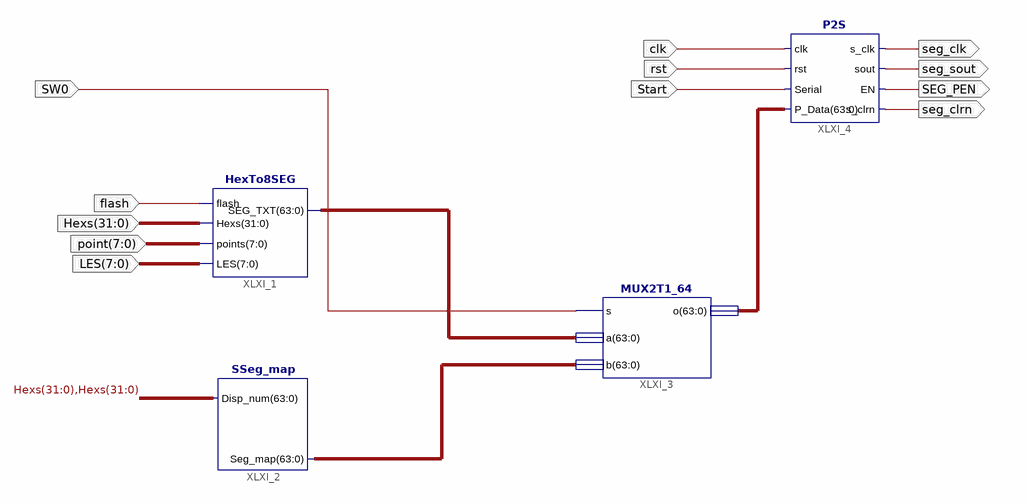
[diagram p0: schematic sheet 1]
// Xilinx ISE schematic Display.sch (kintex7) as structural Verilog: 4 symbols, 12 ports
module Display (
  input  [7:0] LES,
  input  [7:0] point,
  input  [31:0] Hexs,
  input  flash,
  input  SW0,
  input  Start,
  input  rst,
  input  clk,
  output seg_clrn,
  output SEG_PEN,
  output seg_sout,
  output seg_clk
);

  wire [63:0] XLXN_1, XLXN_2, XLXN_8;

  HexTo8SEG XLXI_1 (.LES(LES), .points(point), .Hexs(Hexs), .SEG_TXT(XLXN_1), .flash(flash));
  SSeg_map XLXI_2 (.Disp_num({Hexs, Hexs}), .Seg_map(XLXN_2));
  MUX2T1_64 XLXI_3 (.s(SW0), .a(XLXN_1), .b(XLXN_2), .o(XLXN_8));
  P2S XLXI_4 (
    .s_clrn(seg_clrn), .sout(seg_sout), .rst(rst), .EN(SEG_PEN), .Serial(Start), .clk(clk), .s_clk(seg_clk),
    .P_Data(XLXN_8));
endmodule
